# Altium schematic sheet mcu.SchDoc
size A3; DocumentNumber: 6; SheetNumber: 6; SheetTotal: 13; Organization: Arribada Initiative; Address1: https://github.com/arribada; Address2: contact@arribada.org; Address3: arribada.org; Address4: UK - Porthmouth
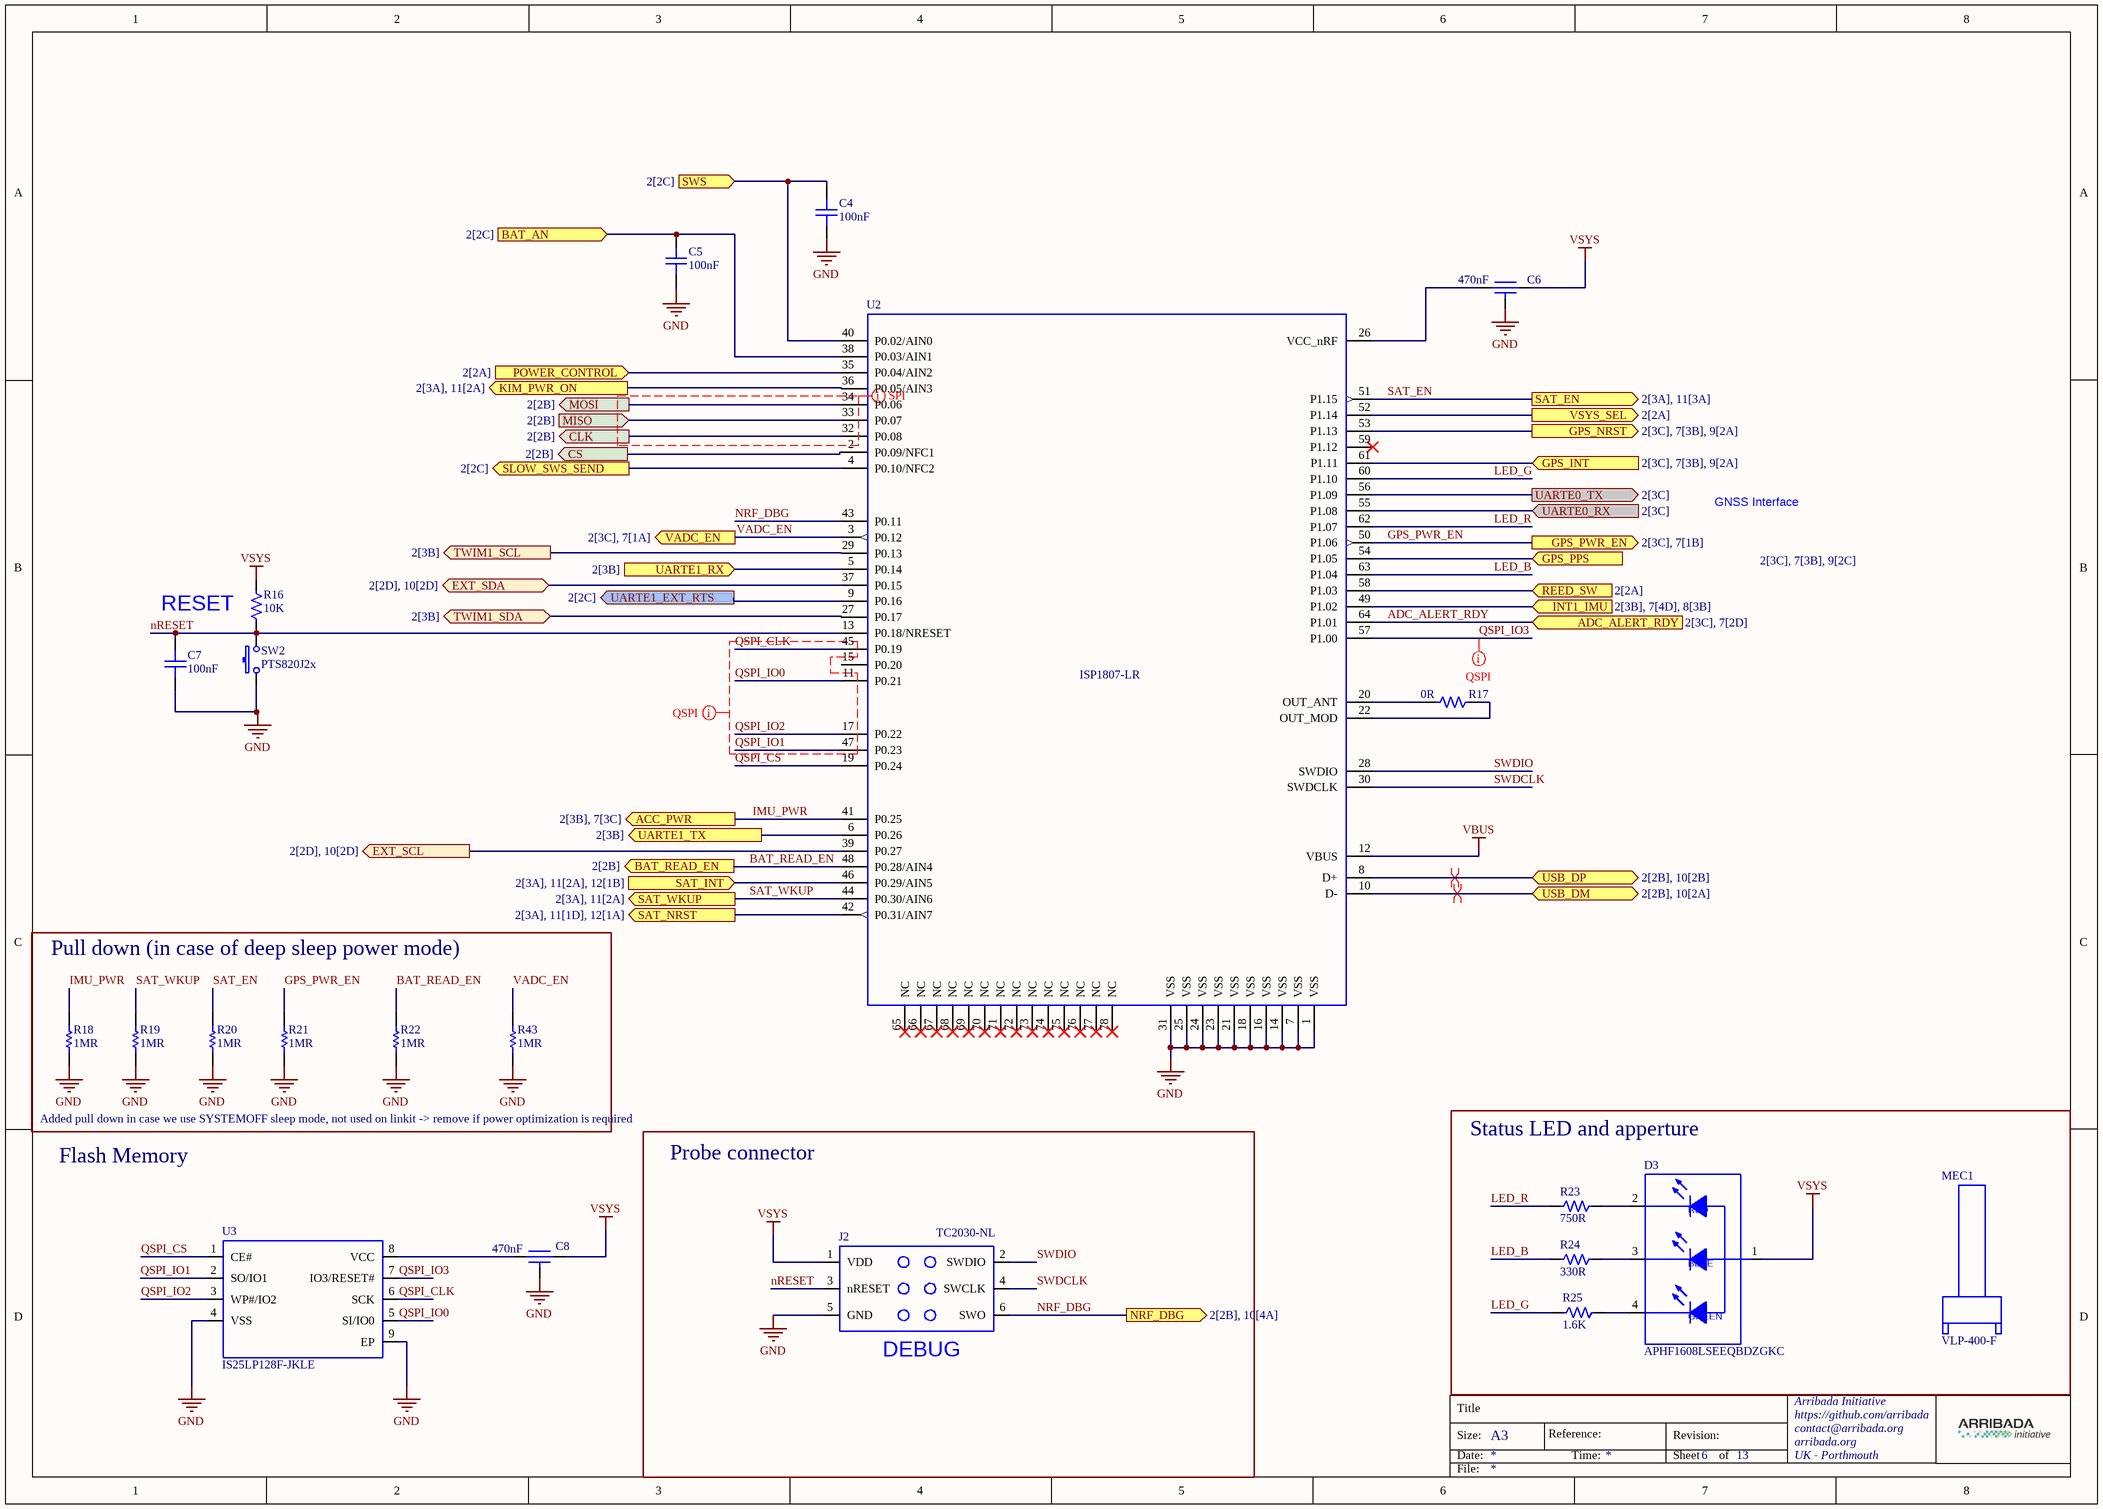
[diagram p0: mcu.SchDoc]

## Parts
C4  value 100nF  [CAP0201L]  (hidden comment: 100NF 0201 35V 10% X5R)
C5  value 100nF  [CAP0201L]  (hidden comment: 100NF 0201 35V 10% X5R)
C6  value 470nF  [YFF15PC]  (hidden comment: 470NF 0402 6.3V +50%/-20%)
C7  value 100nF  [CAP0201L]  (hidden comment: 100NF 0201 35V 10% X5R)
C8  value 470nF  [YFF15PC]  (hidden comment: 470NF 0402 6.3V +50%/-20%)
D3  APHF1608LSEEQBDZGKC  [LED RGB 0603]
J2  TC2030-NL  [TC2030NL]
MEC1  VLP-400-F  [VLP-400-F]
R16  value 10K  [RES0201L]  (hidden comment: 10K 0201 1% 100PPM)
R17  value 0R  [RES0201N]  (hidden comment: 0R 0201)
R18  value 1MR  [RESC0603X26N]  (hidden comment: RC0201FR-7D1ML)
R19  value 1MR  [RESC0603X26N]  (hidden comment: RC0201FR-7D1ML)
R20  value 1MR  [RESC0603X26N]  (hidden comment: RC0201FR-7D1ML)
R21  value 1MR  [RESC0603X26N]  (hidden comment: RC0201FR-7D1ML)
R22  value 1MR  [RESC0603X26N]  (hidden comment: RC0201FR-7D1ML)
R23  value 750R  [RES0201L]  (hidden comment: 750R 0201 1% 100PPM)
R24  value 330R  [RES0201L]  (hidden comment: 330R 0201 1% 100PPM)
R25  value 1.6K  [RES0201L]  (hidden comment: 1.6K 0201 1% 100PPM)
R43  value 1MR  [RESC0603X26N]  (hidden comment: RC0201FR-7D1ML)
SW2  PTS820J2x  [TL1015]
U2  ISP1807-LR  [ISP1807-LR]
U3  IS25LP128F-JKLE  [SON127P600X80_HS-9N]

## Blocks framed on the sheet
Pull down (in case of deep sleep power mode): R18-R22 R43
Probe connector: J2
Status LED and apperture: D3 MEC1 R23-R25

## Ports
ACC_PWR (out, see 2[3B], 7[3C]), ADC_ALERT_RDY (in, see 2[3C], 7[2D]), BAT_AN (in, see 2[2C]), BAT_READ_EN (out, see 2[2B]), CLK (out, see 2[2B]), CS (out, see 2[2B]), EXT_SCL (out, see 2[2D], 10[2D]), EXT_SDA (bidir, see 2[2D], 10[2D]), GPS_INT (in, see 2[3C], 7[3B], 9[2A]), GPS_NRST (out, see 2[3C], 7[3B], 9[2A]), GPS_PPS (in, see 2[3C], 7[3B], 9[2C]), GPS_PWR_EN (out, see 2[3C], 7[1B]), INT1_IMU (in, see 2[3B], 7[4D], 8[3B]), KIM_PWR_ON (out, see 2[3A], 11[2A]), MISO (in, see 2[2B]), MOSI (out, see 2[2B]), NRF_DBG (out, see 2[2B], 10[4A]), POWER_CONTROL (in, see 2[2A]), REED_SW (in, see 2[2A]), SAT_EN (out, see 2[3A], 11[3A]), SAT_INT (in, see 2[3A], 11[2A], 12[1B]), SAT_NRST (out, see 2[3A], 11[1D], 12[1A]), SAT_WKUP (out, see 2[3A], 11[2A]), SLOW_SWS_SEND (out, see 2[2C]), SWS (in, see 2[2C]), TWIM1_SCL (out, see 2[3B]), TWIM1_SDA (bidir, see 2[3B]), UARTE0_RX (in, see 2[3C]), UARTE0_TX (out, see 2[3C]), UARTE1_EXT_RTS (out, see 2[2C]), UARTE1_RX (in, see 2[3B]), UARTE1_TX (out, see 2[3B]), USB_DM (bidir, see 2[2B], 10[2A]), USB_DP (bidir, see 2[2B], 10[2B]), VADC_EN (out, see 2[3C], 7[1A]), VSYS_SEL (out, see 2[2A])

## Nets
GND: C4.1 C5.1 C6.3 C7.1 C8.3 J2.5(GND) R18.1 R19.1 R20.1 R21.1 R22.1 R43.1 SW2.1 SW2.G1 SW2.G2 SW2.G3 SW2.G4 U2.1(VSS) U2.7(VSS) U2.14(VSS) U2.16(VSS) U2.18(VSS) U2.21(VSS) U2.23(VSS) U2.24(VSS) U2.25(VSS) U2.31(VSS) U3.4(VSS) U3.9(EP)
VBUS: U2.12(VBUS)
VSYS: C6.1 C8.1 D3.1 J2.1(VDD) R16.2
ADC_ALERT_RDY: U2.64(P1.01) ; port ADC_ALERT_RDY
BAT_AN: C5.2 U2.38(P0.03/AIN1) ; port BAT_AN
BAT_READ_EN: R22.2 U2.48(P0.28/AIN4) ; port BAT_READ_EN
CLK: U2.32(P0.08) ; port CLK
CS: U2.2(P0.09/NFC1) ; port CS
EXT_SCL: U2.39(P0.27) ; port EXT_SCL
EXT_SDA: U2.37(P0.15) ; port EXT_SDA
GPS_INT: U2.61(P1.11) ; port GPS_INT
GPS_NRST: U2.53(P1.13) ; port GPS_NRST
GPS_PPS: U2.54(P1.05) ; port GPS_PPS
GPS_PWR_EN: R21.2 U2.50(P1.06) ; port GPS_PWR_EN
IMU_PWR: R18.2 U2.41(P0.25) ; port ACC_PWR
INT1_IMU: U2.49(P1.02) ; port INT1_IMU
KIM_PWR_ON: U2.36(P0.05/AIN3) ; port KIM_PWR_ON
LED_B: R24.1 U2.63(P1.04)
LED_G: R25.1 U2.60(P1.10)
LED_R: R23.1 U2.62(P1.07)
MISO: U2.33(P0.07) ; port MISO
MOSI: U2.34(P0.06) ; port MOSI
nRESET: C7.2 J2.3(nRESET) R16.1 SW2.2 U2.13(P0.18/NRESET)
NRF_DBG: J2.6(SWO) U2.43(P0.11) ; port NRF_DBG
POWER_CONTROL: U2.35(P0.04/AIN2) ; port POWER_CONTROL
QSPI_CLK: U2.45(P0.19) U3.6(SCK)
QSPI_CS: U2.19(P0.24) U3.1(CE#)
QSPI_IO0: U2.11(P0.21) U3.5(SI/IO0)
QSPI_IO1: U2.47(P0.23) U3.2(SO/IO1)
QSPI_IO2: U2.17(P0.22) U3.3(WP#/IO2)
QSPI_IO3: U2.57(P1.00) U3.7(IO3/RESET#)
REED_SW: U2.58(P1.03) ; port REED_SW
SAT_EN: R20.2 U2.51(P1.15) ; port SAT_EN
SAT_INT: U2.46(P0.29/AIN5) ; port SAT_INT
SAT_NRST: U2.42(P0.31/AIN7) ; port SAT_NRST
SAT_WKUP: R19.2 U2.44(P0.30/AIN6) ; port SAT_WKUP
SLOW_SWS_SEND: U2.4(P0.10/NFC2) ; port SLOW_SWS_SEND
SWDCLK: J2.4(SWCLK) U2.30(SWDCLK)
SWDIO: J2.2(SWDIO) U2.28(SWDIO)
SWS: C4.2 U2.40(P0.02/AIN0) ; port SWS
TWIM1_SCL: U2.29(P0.13) ; port TWIM1_SCL
TWIM1_SDA: U2.27(P0.17) ; port TWIM1_SDA
UARTE0_RX: U2.55(P1.08) ; port UARTE0_RX
UARTE0_TX: U2.56(P1.09) ; port UARTE0_TX
UARTE1_EXT_RTS: U2.9(P0.16) ; port UARTE1_EXT_RTS
UARTE1_RX: U2.5(P0.14) ; port UARTE1_RX
UARTE1_TX: U2.6(P0.26) ; port UARTE1_TX
USB_DM: U2.10(D-) ; port USB_DM
USB_DP: U2.8(D+) ; port USB_DP
VADC_EN: R43.2 U2.3(P0.12) ; port VADC_EN
VSYS_SEL: U2.52(P1.14) ; port VSYS_SEL
NetC6_2: C6.2 U2.26(VCC_nRF)
NetC8_2: C8.2 U3.8(VCC)
NetD3_2: D3.2 R23.2
NetD3_3: D3.3 R24.2
NetD3_4: D3.4 R25.2
NetR17_1: R17.1 U2.20(OUT_ANT)
NetR17_2: R17.2 U2.22(OUT_MOD)

Not connected (* = marked no-connect by the designer): U2 15(P0.20) 59(P1.12)* 65(NC)* 66(NC)* 67(NC)* 68(NC)* 69(NC)* 70(NC)* 71(NC)* 72(NC)* 73(NC)* 74(NC)* 75(NC)* 76(NC)* 77(NC)* 78(NC)*

## Layout directives
net class QSPI: QSPI_CLK, QSPI_IO0, QSPI_IO1, QSPI_IO2, QSPI_IO3
differential pair; rule Impedance Constraint [Min = 80.00    Max = 100.0    ]; differential pair class USB: USB_DM, USB_DP
net class SPI: (no net found under the mark)

## Notes on the sheet
- GNSS Interface
- RESET
- Added pull down in case we use SYSTEMOFF sleep mode, not used on linkit -> remove if power optimization is required
- Flash Memory
- Title
- Size:
- Date:
- A3
- Reference:
- Time:
- Revision:
- Sheet
- of
- File:
- (in symbol LED RGB 0603 2MA) RED; BLUE; GREEN
- (in symbol TC2030-NL) DEBUG

## Library data of the parts
C4 C5 C7 = CAP CER 100NF 0201 35V 10% X5R: Manufacturer: Murata; Manufacturers Part Number: GRM033R6YA104KE14D; Tolerance: 10%; Size: 0201; Dielectric: X5R; Supplier 1: Mouser; Supplier 2: Digi-Key; Supplier Part Number 1: 81-GRM33R6YA104KE14D; Supplier Part Number 2: 490-10430-1-ND
C6 C8 = CAP FEEDTHRU 470NF 0402 6.3V +50%/-20%: Manufacturer: TDK; Manufacturers Part Number: YFF15PC0J474M; Tolerance: +50%/-20%; Size: 0402; Voltage: 6.3V; Supplier 1: Mouser; Supplier 2: Digi-Key; Supplier Part Number 1: 810-CKD710JB0J474S; Supplier Part Number 2: 445-8050-1-ND
D3 = LED RGB 0603 2MA: Manufacturer: Kingbright; Manufacturers Part Number: APHF1608LSEEQBDZGKC; Supplier 1: Mouser; Supplier 2: Digi-Key; Supplier Part Number 1: 604-APHF1608LQBDZGKC; Supplier Part Number 2: 754-2143-1-ND; Distributor 1: EBV; Distributor 2: Future Electronics; Colour: RGB; Value: APHF1608LSEEQBDZGKC
J2 = TC2030-NL: CON PLUG OF NAILS 6 PIN FOOTPRINT NO LEGS; Manufacturer: Tag-Connect; Manufacturers Part Number: NOT FITTED PART; Supplier Part Number 1: NOT FITTED PART; Supplier Part Number 2: NOT FITTED PART; Distributor 1: EBV; Distributor 2: Future Electronics
MEC1 = VLP-400-F: LIGHT PIPE 10.2mm High Flat Face; Manufacturer: Bivar Inc; Manufacturers Part Number: VLP-400-F; Supplier 1: Digi-Key; Supplier 2: Mouser; Supplier Part Number 1: 492-1516-ND; Supplier Part Number 2: 749-VLP-400-F
R16 = RES 10K 0201 1% 100PPM: PPM: 100; Manufacturer: *; Manufacturers Part Number: *; Tolerance: 1%; Size: 0201; Supplier 1: Mouser; Supplier 2: Digi-Key; Supplier Part Number 1: 71-CRCW020110K0FKED; Supplier Part Number 2: 541-10.0KAABCT-ND
R17 = RES 0R 0201: Manufacturer: *; Manufacturers Part Number: *; Size: 0201; Supplier 1: Mouser; Supplier 2: Digi-Key; Supplier Part Number 1: 71-CRCW02010000Z0ED; Supplier Part Number 2: 541-0.0AGCT-ND
R18-R22 R43 = RC0201FR-7D1ML: Thick Film Resistors - SMD 1 MOhms 50 mW 0201 1%; Manufacturer_Name: KEMET; Datasheet Link: http://www.yageo.com/documents/recent/PYu-RC0201_51_RoHS_L_8.pdf; Height: 0.26mm; Manufacturer_Part_Number: RC0201FR-7D1ML; Mouser Part Number: 603-RC0201FR-7D1ML; Mouser Price/Stock: https://www.mouser.co.uk/ProductDetail/YAGEO/RC0201FR-7D1ML?qs=NgbZBzc1CyEo5FlGf5N0Ug%3D%3D; Arrow Part Number: RC0201FR-7D1ML; Arrow Price/Stock: https://www.arrow.com/en/products/rc0201fr-7d1ml/yageo
R23 = RES 750R 0201 1% 100PPM: PPM: 100; Manufacturer: *; Manufacturers Part Number: *; Tolerance: 1%; Size: 0201; Supplier 1: Mouser; Supplier 2: Digi-Key; Supplier Part Number 1: 71-CRCW0201750RFKED; Supplier Part Number 2: 541-750AABCT-ND
R24 = RES 330R 0201 1% 100PPM: PPM: 100; Manufacturer: *; Manufacturers Part Number: *; Tolerance: 1%; Size: 0201; Supplier 1: Mouser; Supplier 2: Digi-Key; Supplier Part Number 1: 71-CRCW0201330RFKED; Supplier Part Number 2: 541-330AABCT-ND
R25 = RES 1.6K 0201 1% 100PPM: PPM: 100; Manufacturer: *; Manufacturers Part Number: *; Tolerance: 1%; Size: 0201; Supplier 1: Mouser; Supplier 2: Digi-Key; Supplier Part Number 1: 71-CRCW02011K60FKED; Supplier Part Number 2: 541-1.60KAABCT-ND
SW2 = PTS820J2x: SW SPST PB 50MA 12V SMT CK variant; Manufacturer: C&K; Manufacturers Part Number: PTS820J2xM SMTR LFS; Supplier 1: Mouser; Supplier 2: Digi-Key; Supplier Part Number 1: 611-PTS820J25MSMTR; Supplier Part Number 2: CKN10505CT-ND; Distributor 1: EBV; Distributor 2: Future Electronics; Value: PTS820J2x
U2 = ISP1807-LR: IC ISP Smart Bluetooth Module; Manufacturer: InsightSIP; Manufacturers Part Number: ISP1807-LR-ST; Temp Min: -40; Temp Max: 85; Supplier 1: Rutronik; Supplier Part Number 1: ISP1807-LR-ST; Supplier 2: Mouser; Supplier Part Number 2: 359-ISP1807-LR-ST; Supplier Unit Price 1: 8.5
U3 = IS25LP128F-JKLE: IC MEM SERIAL NOR FLASH QSPI 128Mb/16MB 3.6V 166MHz WSON8 6X5; Manufacturer: ISSI; Manufacturers Part Number: IS25LP128F-JKLE; Temp Min: -40; Temp Max: 105; Supplier 1: Farnell; Supplier Part Number 1: 2901145; Supplier 2: Mouser; Supplier Part Number 2: 870-IS25LP128FJKLETR; Distributor 1: EBV; Distributor 2: Future Electronics